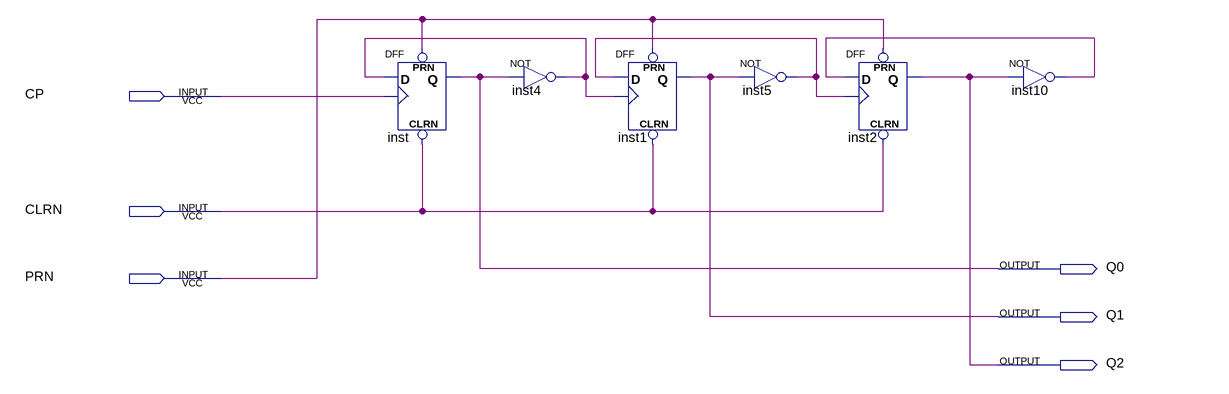
[diagram p0: schematic sheet]
// Quartus schematic counter_8.bdf as structural Verilog: 6 symbols, 6 pins
module counter_8 (
  input  CP,
  input  CLRN,
  input  PRN,
  output Q0,
  output Q1,
  output Q2
);

  wire inst4_out, inst5_out, inst10_out;

  DFF inst (.CLRN(CLRN), .CLK(CP), .D(inst4_out), .PRN(PRN), .Q(Q0));
  not inst4 (inst4_out, Q0);
  DFF inst1 (.CLRN(CLRN), .CLK(inst4_out), .D(inst5_out), .PRN(PRN), .Q(Q1));
  not inst5 (inst5_out, Q1);
  DFF inst2 (.CLRN(CLRN), .CLK(inst5_out), .D(inst10_out), .PRN(PRN), .Q(Q2));
  not inst10 (inst10_out, Q2);
endmodule
